# EAGLE schematic AstroEQ SMD V4.7 (EQ5) (EAGLE 6.6.0)
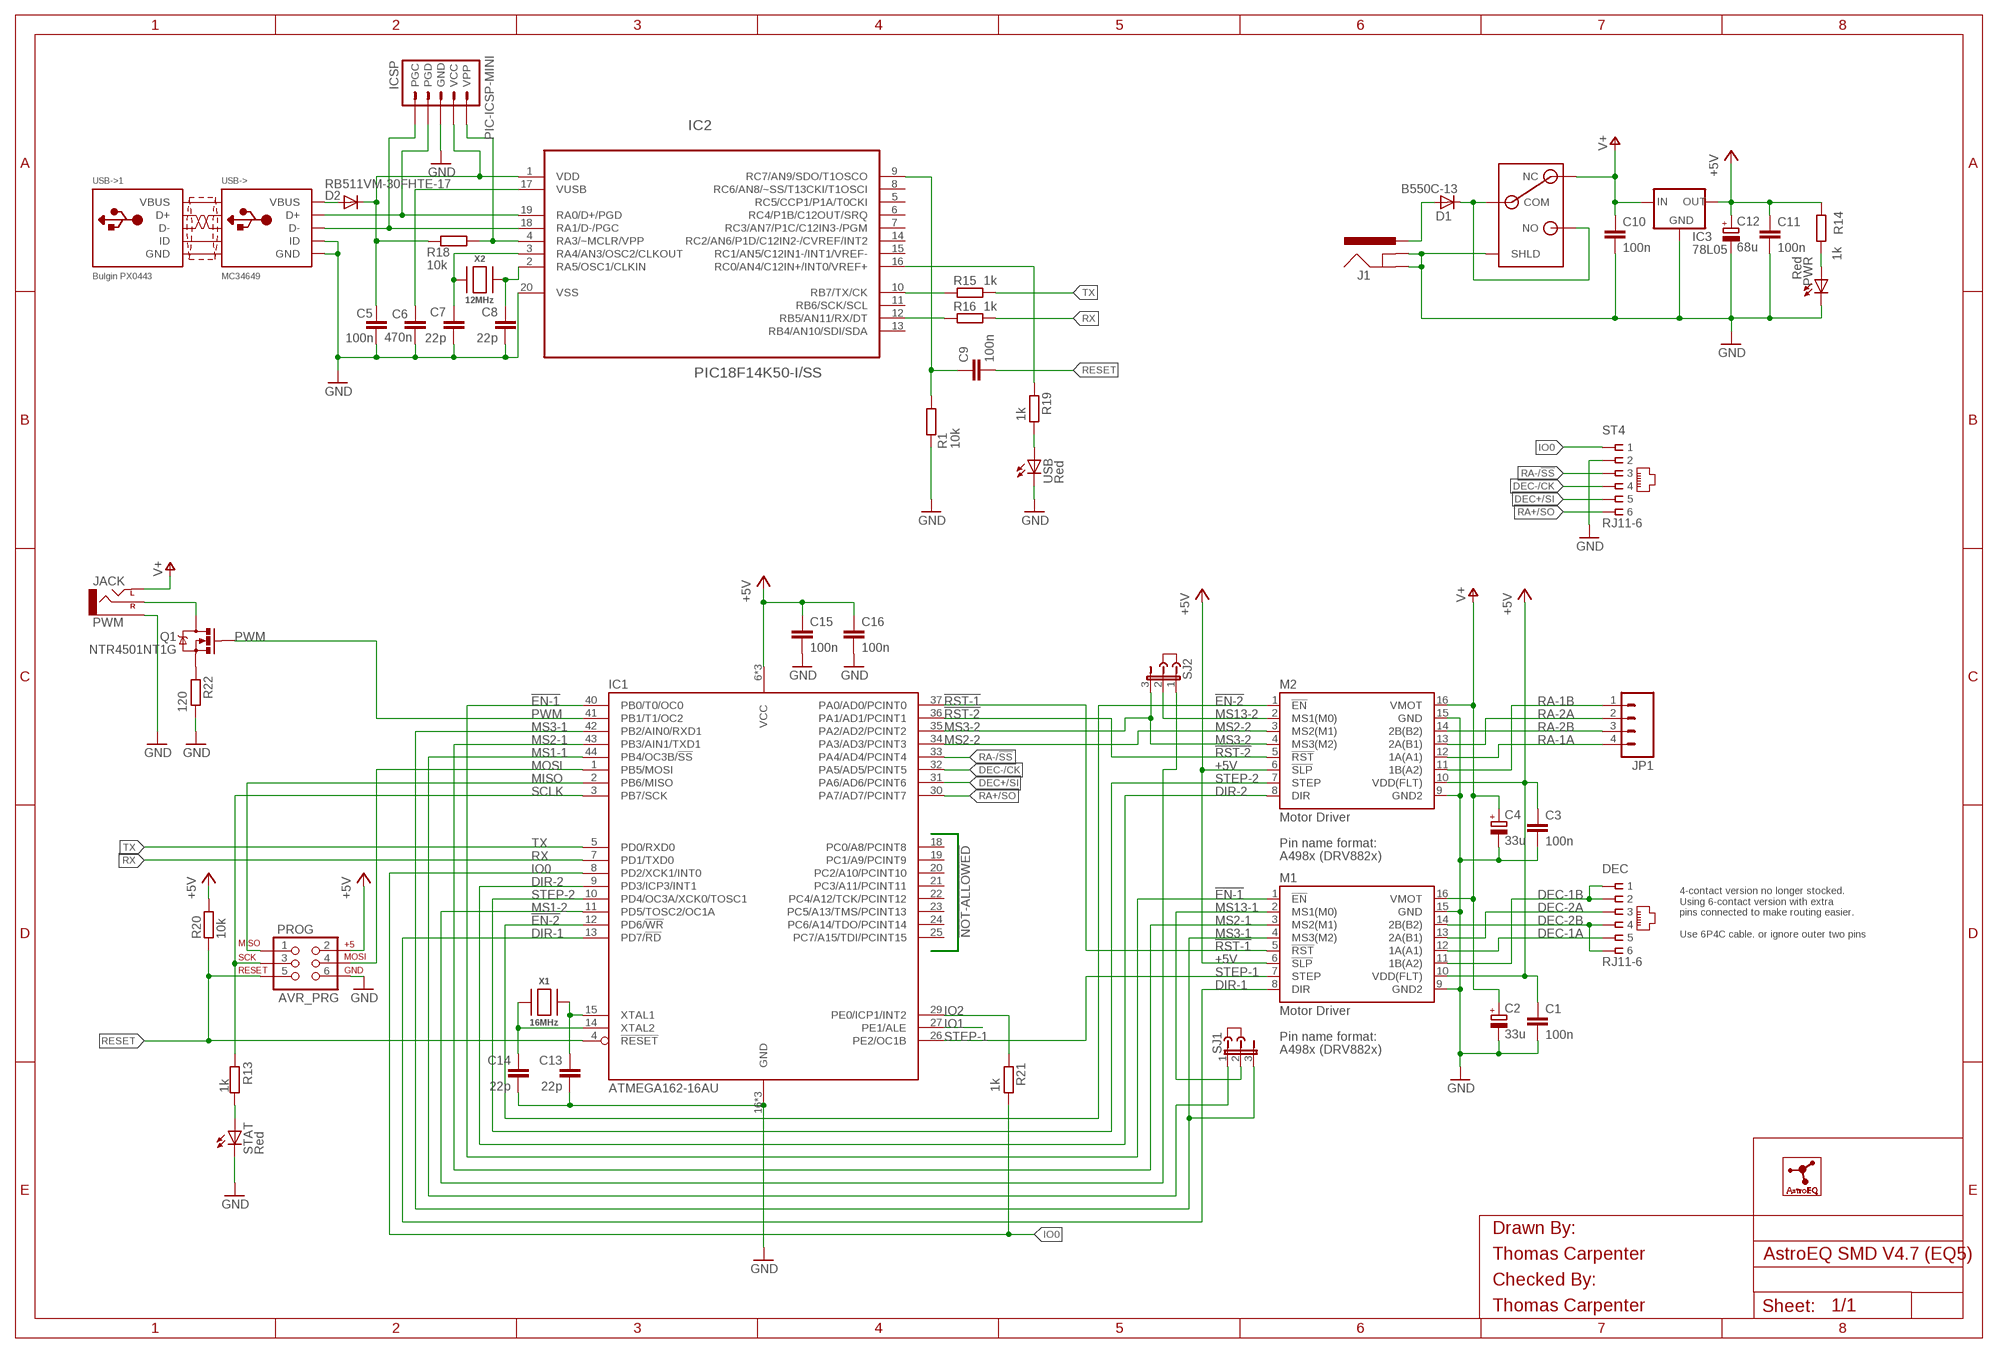
[diagram p0: schematic, sheet 1]
FRAME1 (A3L-LOC): CHECKED_BY: Thomas Carpenter; DRAWN_BY: Thomas Carpenter
USB->1 (USB-PANEL): MF: BULGIN; MPN: PX0443; OC_FARNELL: 1229685

## Parts
C1  100n  C-EUC0603  [C0603]
C2  33u  CPOL-EUSMCC  [SMC_C]
C3  100n  C-EUC0603  [C0603]
C4  33u  CPOL-EUSMCC  [SMC_C]
C5  100n  C-EUC0603  [C0603]
C6  470n  C-EUC0603  [C0603]
C7  22p  C-EUC0603  [C0603]
C8  22p  C-EUC0603  [C0603]
C9  100n  C-EUC0603  [C0603]
C10  100n  C-EUC0603  [C0603]
C11  100n  C-EUC0603  [C0603]
C12  68u  CPOL-EUSMCC  [SMC_C]
C13  22p  C-EUC0603  [C0603]
C14  22p  C-EUC0603  [C0603]
C15  100n  C-EUC0603  [C0603]
C16  100n  C-EUC0603  [C0603]
D1  B550C-13  DIODE-SMC  [SMC]
D2  RB511VM-30FHTE-17  DIODESOD  [SOD-323]
DEC  RJ11-6  RJ11-2L-B  [RJ11-NO_SHIELD]
IC1  ATMEGA162-16AU  [TQFP44]
IC2  PIC18F14K50-I/SS  [SS20]
IC3  78L05  78LXXSOT-23  [SOT23]
ICSP  PIC-ICSP-MINI  [PIC-ICSP-MINI]
J1  POWER_JACKPANEL  [POWER_JACK_PANEL]
J2  JUMPER  [JUMP]
J3  JUMPER  [JUMP]
JP1  M04POLAR  [MOLEX-1X4]
LOGO1  ASTROEQ5MM  [ASTROEQ-SMALL]
M1  Motor Driver  A4983CARRIER  [DIP16-W]
M2  Motor Driver  A4983CARRIER  [DIP16-W]
PROG  AVR_PRG  AVR_SPI_PRG_6PTH  [2X3]
PWM  JACK  AUDIO-JACKVERT  [AUDIO-JACK-3.5MM-VERT]
PWR  Red  LED3MM  [LED3MM]
PWR-SW  SWITCH  [SPST]
Q1  NTR4501NT1G  MOSFET-NCHANNELSMD  [SOT23-3]
R1  10k  R-EU_R0603  [R0603]
R13  1k  R-EU_R0603  [R0603]
R14  1k  R-EU_R0603  [R0603]
R15  1k  R-EU_R0603  [R0603]
R16  1k  R-EU_R0603  [R0603]
R18  10k  R-EU_R0603  [R0603]
R19  1k  R-EU_R0603  [R0603]
R20  10k  R-EU_R0603  [R0603]
R21  1k  R-EU_R0603  [R0603]
R22  120  R-EU_R0805  [R0805]
SJ1  JP2E  [JP2]
SJ2  JP2E  [JP2]
ST4  RJ11-6  RJ11-2L-B  [RJ11-NO_SHIELD]
STAT  Red  LED3MM  [LED3MM]
USB  Red  LED3MM  [LED3MM]
USB->  MC34649  USBBULGINWIRE  [22-23-2051]
X1  16MHz  XTALNX5032  [NX5032]
X2  12MHz  XTALNX5032  [NX5032]

## Nets
!EN-1: IC1.40(PB0/T0/OC0) M1.1(!EN)
!EN-2: IC1.12(PD6/!WR) M2.1(!EN)
!RST-1: IC1.37(PA0/AD0/PCINT0) M1.5(!RST)
!RST-2: IC1.36(PA1/AD1/PCINT1) M2.5(!RST)
+5V: C1.1 C3.1 C11.1 C12.+ C15.1 C16.1 IC1.6(VCC) IC1.17(VCC) IC1.38(VCC) IC3.1(OUT) M1.6(!SLP) M1.10(VDD(FLT)) M2.6(!SLP) M2.10(VDD(FLT)) PROG.2 R14.1 R20.2
AVROSC1: C13.1 IC1.15(XTAL1) X1.P$1
AVROSC2: C14.1 IC1.14(XTAL2) X1.P$2
D_N [usbdat]: IC2.18(RA1/D-/PGC) ICSP.5(PGC) USB->.2(D-)
D_P [usbdat]: IC2.19(RA0/D+/PGD) ICSP.4(PGD) USB->.3(D+)
DEC+/SI: IC1.31(PA6/AD6/PCINT6) ST4.5
DEC-1A: DEC.5 M1.12(1A(A1))
DEC-1B: DEC.1 DEC.2 M1.11(1B(A2))
DEC-2A: DEC.3 M1.13(2A(B1))
DEC-2B: DEC.4 DEC.6 M1.14(2B(B2))
DEC-/CK: IC1.32(PA5/AD5/PCINT5) ST4.4
DIR-1: IC1.13(PD7/!RD) M1.8(DIR)
DIR-2: IC1.9(PD3/ICP3/INT1) M2.8(DIR)
DTR: C9.1 IC2.9(RC7/AN9/SDO/T1OSCO) R1.1
GND: C1.2 C2.- C3.2 C4.- C5.2 C6.1 C7.2 C8.2 C10.2 C11.2 C12.- C13.2 C14.2 C15.2 C16.2 IC1.16(GND) IC1.28(GND) IC1.39(GND) IC2.20(VSS) IC3.3(GND) ICSP.3(GND) J1.SHUNT(GNDBREAK) J1.SLEEVE(GND) M1.9(GND2) M1.15(GND) M2.9(GND2) M2.15(GND) PROG.6 PWM.1(SLEEVE) PWR-SW.S1(SHLD) PWR-SW.S2(SHLD) PWR-SW.S3(SHLD) PWR-SW.S4(SHLD) PWR.K(C) R1.2 R22.1 ST4.2 STAT.K(C) USB->.4(GND) USB->.5(ID) USB.K(C)
IO0: IC1.8(PD2/XCK1/INT0) R21.1 ST4.1
IO1: IC1.27(PE1/ALE)
IO2: IC1.29(PE0/ICP1/INT2) R21.2
MCLR: IC2.4(RA3/~MCLR/VPP) ICSP.1(VPP) R18.1
MISO: IC1.2(PB6/MISO) PROG.1
MOSI: IC1.1(PB5/MOSI) PROG.4
MS1-1: IC1.44(PB4/OC3B/!SS) SJ1.1
MS1-2: IC1.11(PD5/TOSC2/OC1A) SJ2.1
MS2-1: IC1.43(PB3/AIN1/TXD1) M1.3(MS2(M1))
MS2-2: IC1.34(PA3/AD3/PCINT3) M2.3(MS2(M1))
MS3-1: IC1.42(PB2/AIN0/RXD1) M1.4(MS3(M2)) SJ1.3
MS3-2: IC1.35(PA2/AD2/PCINT2) M2.4(MS3(M2)) SJ2.3
MS13-1: M1.2(MS1(M0)) SJ1.2
MS13-2: M2.2(MS1(M0)) SJ2.2
PWM: IC1.41(PB1/T1/OC2) Q1.1(G)
PWM-OUT: PWM.3(RIGHT) Q1.3(D)
PWM-RES: Q1.2(S) R22.2
PWRLED: PWR.A R14.2
RA+/SO: IC1.30(PA7/AD7/PCINT7) ST4.6
RA-1A: JP1.4 M2.12(1A(A1))
RA-1B: JP1.1 M2.11(1B(A2))
RA-2A: JP1.2 M2.13(2A(B1))
RA-2B: JP1.3 M2.14(2B(B2))
RA-/!SS: IC1.33(PA4/AD4/PCINT4) ST4.3
RESET: C9.2 IC1.4(!RESET) PROG.5 R20.1
RX: IC1.7(PD1/TXD0) R16.1
RX(USB): IC2.12(RB5/AN11/RX/DT) R16.2
SCLK: IC1.3(PB7/SCK) PROG.3 R13.1
STATLED: R13.2 STAT.A
STEP-1: IC1.26(PE2/OC1B) M1.7(STEP)
STEP-2: IC1.10(PD4/OC3A/XCK0/TOSC1) M2.7(STEP)
SWITCH: D1.C PWR-SW.COM PWR-SW.NO
TX: IC1.5(PD0/RXD0) R15.1
TX(USB): IC2.10(RB7/TX/CK) R15.2
USBLED: R19.1 USB.A
USBOSC1: C8.1 IC2.2(RA5/OSC1/CLKIN) X2.P$2
USBOSC2: C7.1 IC2.3(RA4/AN3/OSC2/CLKOUT) X2.P$1
USBSTAT: IC2.16(RC0/AN4/C12IN+/INT0/VREF+) R19.2
V+: C2.+ C4.+ C10.1 IC3.2(IN) M1.16(VMOT) M2.16(VMOT) PWM.2(LEFT) PWR-SW.NC
VBUS: D2.2(A) USB->.1(VBUS)
VIN: D1.A J1.CENTRE(PWR)
VPIC: C5.1 D2.1(C) IC2.1(VDD) ICSP.2(VCC) R18.2
VUSB: C6.2 IC2.17(VUSB)
Unconnected: IC1.18(PC0/A8/PCINT8) IC1.19(PC1/A9/PCINT9) IC1.20(PC2/A10/PCINT10) IC1.21(PC3/A11/PCINT11) IC1.22(PC4/A12/TCK/PCINT12) IC1.23(PC5/A13/TMS/PCINT13) IC1.24(PC6/A14/TDO/PCINT14) IC1.25(PC7/A15/TDI/PCINT15) IC2.5(RC5/CCP1/P1A/T0CKI) IC2.6(RC4/P1B/C12OUT/SRQ) IC2.7(RC3/AN7/P1C/C12IN3-/PGM) IC2.8(RC6/AN8/~SS/T13CKI/T1OSCI) IC2.11(RB6/SCK/SCL) IC2.13(RB4/AN10/SDI/SDA) IC2.14(RC2/AN6/P1D/C12IN2-/CVREF/INT2) IC2.15(RC1/AN5/C12IN1-/INT1/VREF-)

## Notes on the sheet
- 4-contact version no longer stocked.
  Using 6-contact version with extra
  pins connected to make routing easier.
  
  Use 6P4C cable. or ignore outer two pins

## Library data of the parts
C1 C3 C5 C9-C11 C15 C16 = rcl:C-EU: CAPACITOR, European symbol; MF: MULTICOMP; MPN: MC0603F104Z250CT; OC_FARNELL: 1759038
C2 C4 = rcl:CPOL-EU: POLARIZED CAPACITOR, European symbol; MF: KEMET; MPN: T491C336K025AT; OC_FARNELL: 1793896
C6 = rcl:C-EU: CAPACITOR, European symbol; MF: MULTICOMP; MPN: MC0603F474Z160CT; OC_FARNELL: 1759021
C7 C8 C13 C14 = rcl:C-EU: CAPACITOR, European symbol; MF: MULTICOMP; MPN: MC0603N220J500CT; OC_FARNELL: 1759057
C12 = rcl:CPOL-EU: POLARIZED CAPACITOR, European symbol; MF: AVX; MPN: TPSC686K016R0125; OC_FARNELL: 1658976
D1 = diode:DIODE-: DIODE; MF: DIODES INC.; MPN: B550C-13-F; OC_FARNELL: 1858608
D2 = SparkFun:DIODE: Diode These are standard reverse protection diodes and small signal diodes. SMA package can handle up to about 1A. SOD-323 can handle about 200mA. What the SOD-323 package when ordering, there are some mfgs out there that are 5-pin packages.; MF: ROHM; MPN: RB511VM-30FHTE-17; OC_FARNELL: 2581544
DEC ST4 = con-tycoelectronics:RJ11: CORCOM Modular RJ Jacks No Shield Source: www.tycoelectronics.com .. ENG_DS_1654001_1099_RJ_L_0507.pdf; MF: MOLEX; MPN: 95503-2661; OC_FARNELL: 1620210
IC1 = atmel:ATMEGA162: 8-bit RISC MICROCONTROLLER 16K Bytes internal flash program memory 1K Bytes internal SRAM Upto 64K Bytes optional external memory space 512 Bytes EEPROM Two 8-bit timers Two 16-bit timers Dual programmable serial USARTs Master/Slave serial SPI interface Source: ATMEGA162_DIP40.lbr; MF: ATMEL; MPN: ATMEGA162-16AU; OC_FARNELL: 9171150
IC2 = microchip:PIC18F14K50: USB Flash Microcontrollers; MF: MICROCHIP
IC3 = v-reg:78LXX: VOLTAGE REGULATOR; MF: TAIWAN SEMICONDUCTOR; MPN: TS78L05CX RFG; OC_FARNELL: 1476698
ICSP = SparkFun:PIC-ICSP-MINI: PIC-ICSP-Mini Miniature 5-pin connection for temporary programming of PICs. Use this device in your design to save space. Program the PIC with this adapter Spark Fun Electronics SKU : BOB-00194; OC_FARNELL: unknown
J1 = SparkFun:POWER_JACK: Power Jack This is the standard 5.5mm barrel jack for power. The PTH is the most common, proven, reliable, footprint. All others are experimental. The Slot footprint only works if the mill layer is transmitted to the PCB fab house so be warned. Spark Fun Electronics SKU : PRT-00119. Mating wall wart : TOL-00298 (and others); MF: SWITCHCRAFT; MPN: PCL712AS; OC_FARNELL: 1871167
J2 J3 = jumper:JUMPER: JUMPER header; MF: 3M; MPN: 969102-0000-DA; OC_FARNELL: 2579814
JP1 = SparkFun:M04: Header 4 Standard 4-pin 0.1" header. Use with straight break away headers (SKU : PRT-00116), right angle break away headers (PRT-00553), swiss pins (PRT-00743), machine pins (PRT-00117), and female headers (PRT-00115). Molex polarized connector foot print use with SKU : PRT-08231 with associated crimp pins and housings. 1MM SMD Version SKU: PRT-10208; MF: MULTICOMP; MPN: MC34645; OC_FARNELL: 1675775
LOGO1 = AstroEQTooth:ASTROEQ; OC_FARNELL: unknown
M1 M2 = A4983Carrier:A4983CARRIER; MF: SAMTEC; MPN: CES-116-01-T-S; OC_FARNELL: 1667522
PROG = SparkFun:AVR_SPI_PRG_6: AVR ISP 6 Pin This is the reduced ISP connector for AVR programming. Common on Arduino. This footprint will take up less PCB space and can be used with a 10-pin to 6-pin adapter such as SKU: BOB-08508; MF: AMP - TE CONNECTIVITY; MPN: 826632-3; OC_FARNELL: 3418492
PWM = SparkFun:AUDIO-JACK: 3.5mm Audio Jack Simple 3.5mm common PCB mount audio jack. SKU: PRT-08032; MANUFACTURER: LUMBERG; MF: LUMBERG; MPN: 1502 01; OC_FARNELL: 1243242
PWR STAT USB = led:LED: LED OSRAM: - CHIPLED LG R971, LG N971, LY N971, LG Q971, LY Q971, LO R971, LY R971 LH N974, LH R974 LS Q976, LO Q976, LY Q976 LO Q996 - Hyper CHIPLED LW Q18S LB Q993, LB Q99A, LB R99A - SideLED LS A670, LO A670, LY A670, LG A670, LP A670 LB A673, LV A673, LT A673, LW A673 LH A674 LY A675 LS A676, LA A676, LO A676, LY A676, LW A676 LS A679, LY A679, LG A679 - Hyper Micro SIDELED® LS Y876, LA Y876, LO Y876, LY Y876 LT Y87S - SmartLED LW L88C, LW L88S LB L89C, LB L89S, LG L890 LS L89K, LO L89K, LY L89K LS L896, LA L896, LO L896, LY L896 - TOPLED LS T670, LO T670, LY T670, LG T670, LP T670 LSG T670, LSP T670, LSY T670, LOP T670, LYG T670 LG T671, LOG T671, LSG T671 LB T673, LV T673, LT T673, LW T673 LH T674 LS T676, LA T676, LO T676, LY T676, LB T676, LH T676, LSB T676, LW T676 LB T67C, LV T67C, LT T67C, LS T67K, LO T67K, LY T67K, LW E67C LS E67B, LA E67B, LO E67B, LY E67B, LB E67C, LV E67C, LT E67C LW T67C LS T679, LY T679, LG T679 LS T770, LO T770, LY T770, LG T770, LP T770 LB T773, LV T773, LT T773, LW T773 LH T774 LS E675, LA E675, LY E675, LS T675 LS T776, LA T776, LO T776, LY T776, LB T776 LHGB T686 LT T68C, LB T68C - Hyper Mini TOPLED® LB M676 - Mini TOPLED Santana® LG M470 LS M47K, LO M47K, LY M47K Source: http://www.osram.convergy.de LUXEON: - LUMILED® LXK2-PW12-R00, LXK2-PW12-S00, LXK2-PW14-U00, LXK2-PW14-V00 LXK2-PM12-R00, LXK2-PM12-S00, LXK2-PM14-U00 LXK2-PE12-Q00, LXK2-PE12-R00, LXK2-PE12-S00, LXK2-PE14-T00, LXK2-PE14-U00 LXK2-PB12-K00, LXK2-PB12-L00, LXK2-PB12-M00, LXK2-PB14-N00, LXK2-PB14-P00, LXK2-PB14-Q00 LXK2-PR12-L00, LXK2-PR12-M00, LXK2-PR14-Q00, LXK2-PR14-R00 LXK2-PD12-Q00, LXK2-PD12-R00, LXK2-PD12-S00 LXK2-PH12-R00, LXK2-PH12-S00 LXK2-PL12-P00, LXK2-PL12-Q00, LXK2-PL12-R00 Source: www.luxeon.com KINGBRIGHT: KA-3528ASYC Source: www.kingbright.com; MF: KINGBRIGHT; MPN: L-424HDT; OC_FARNELL: 1142499
PWR-SW = con-tycoelectronics:SWITCH; MF: TE CONNECTIVITY; MPN: AE101J1V3B004; OC_FARNELL: 1813654
Q1 = SparkFun:MOSFET-NCHANNEL; MF: ON SEMICONDUCTOR; MPN: NTR4501NT1G; OC_FARNELL: 1431305
R1 R18 R20 = rcl:R-EU_: RESISTOR, European symbol; MF: MULTICOMP; MPN: MCWR06X1002FTL; OC_FARNELL: 2447230
R13-R16 R19 R21 = rcl:R-EU_: RESISTOR, European symbol; MF: MULTICOMP; MPN: MCWR06X1001FTL; OC_FARNELL: 2447272
R22 = rcl:R-EU_: RESISTOR, European symbol; MF: MULTICOMP; MPN: MCWR08X1200FTL; OC_FARNELL: 2447561
SJ1 SJ2 = jumper:JP2E: JUMPER; MF: MULTICOMP; MPN: 2211S-03G; OC_FARNELL: 1593412
USB-> = adafruit:USB: USB Connectors USBMINIB - Surface Mount Female Mini-B USB Connector 4UConnector: 06564 By microbuilder.eu Thru-hole RA Female Mini-B USB Connector 4UConnector: 18732 By ladyada.net; MF: MULTICOMP; MPN: MC34649; OC_FARNELL: 1675777
X1 = adafruit:XTAL: Low cost SMT crystals, no capacitors included http://www.ladyada.net/library/eagle; MF: TXC; MPN: 7A-16.000MAAJ-T; OC_FARNELL: 1841946
X2 = adafruit:XTAL: Low cost SMT crystals, no capacitors included http://www.ladyada.net/library/eagle; MF: TXC; MPN: 7A-12.000MAAJ-T; OC_FARNELL: 1841940

## Net classes
1 power: width 0.61 mm, drill 0.711 mm, clearance 0.203 mm
2 gnd: width 0.305 mm, drill 0.711 mm, clearance 0.203 mm
3 usbvcc: width 0.508 mm, drill 0.711 mm, clearance 0.203 mm
4 usbdat: width 0.406 mm, clearance 0.152 mm